# Altium schematic sheet STM32_F4VE.SchDoc
size A2
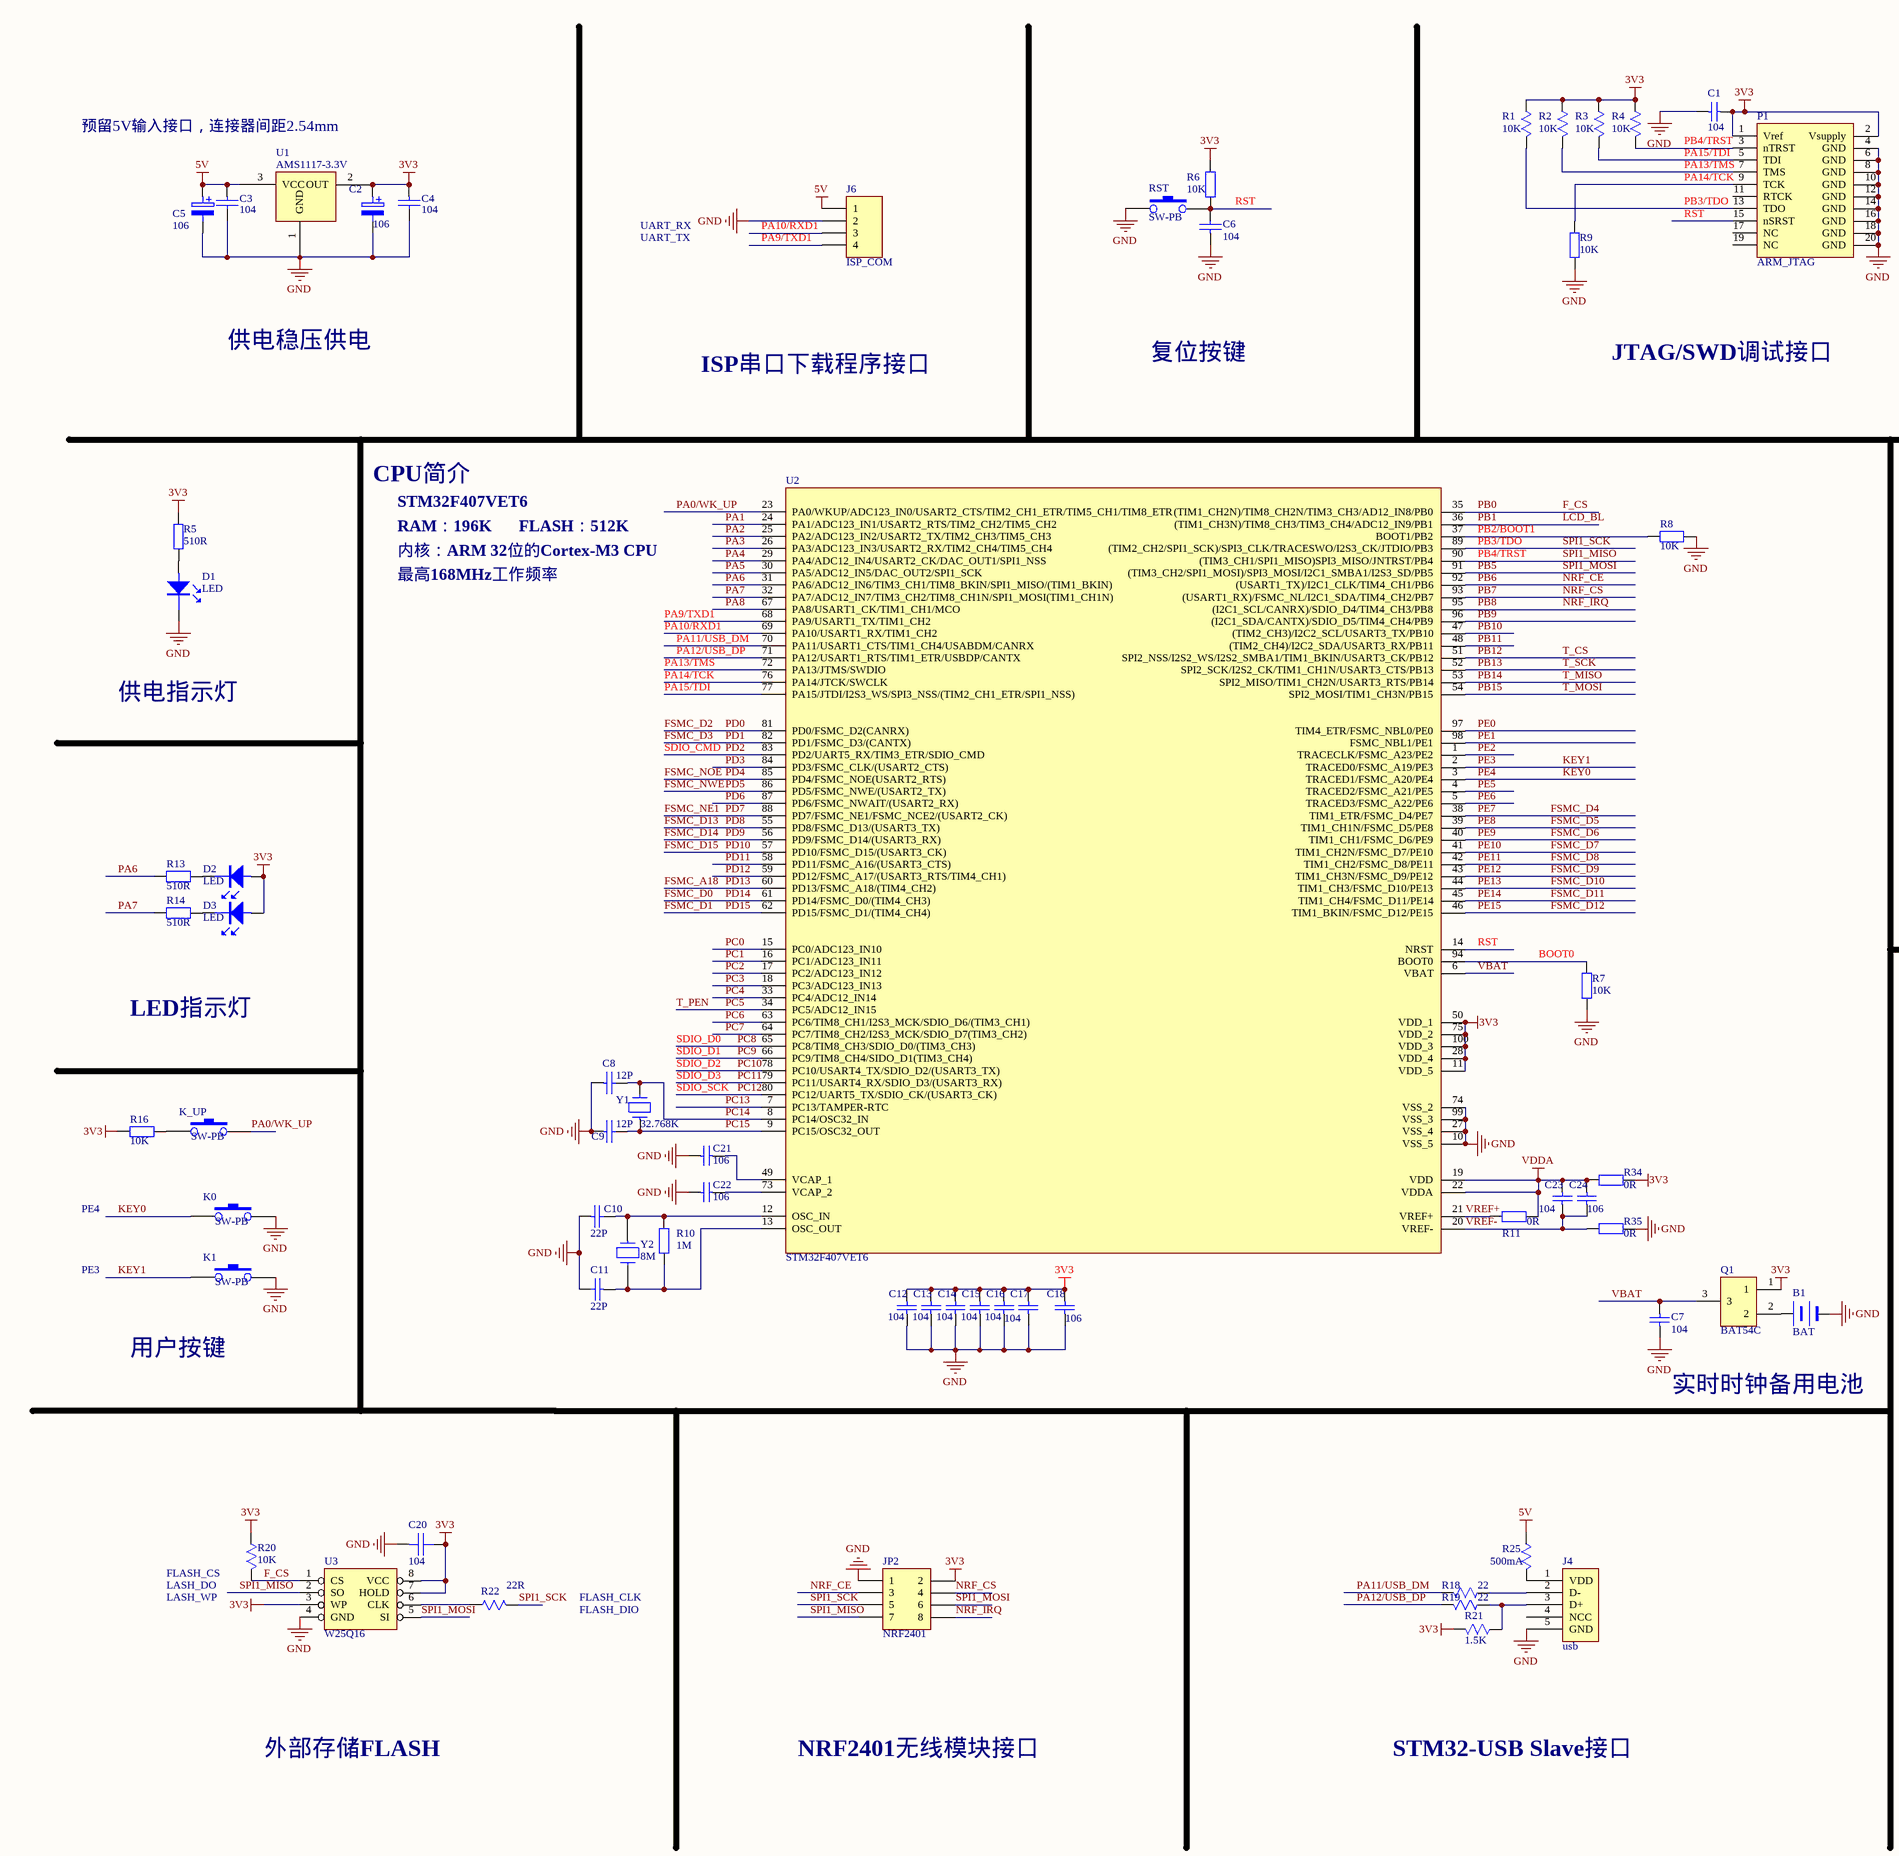
[diagram p0: STM32_F4VE.SchDoc, left]
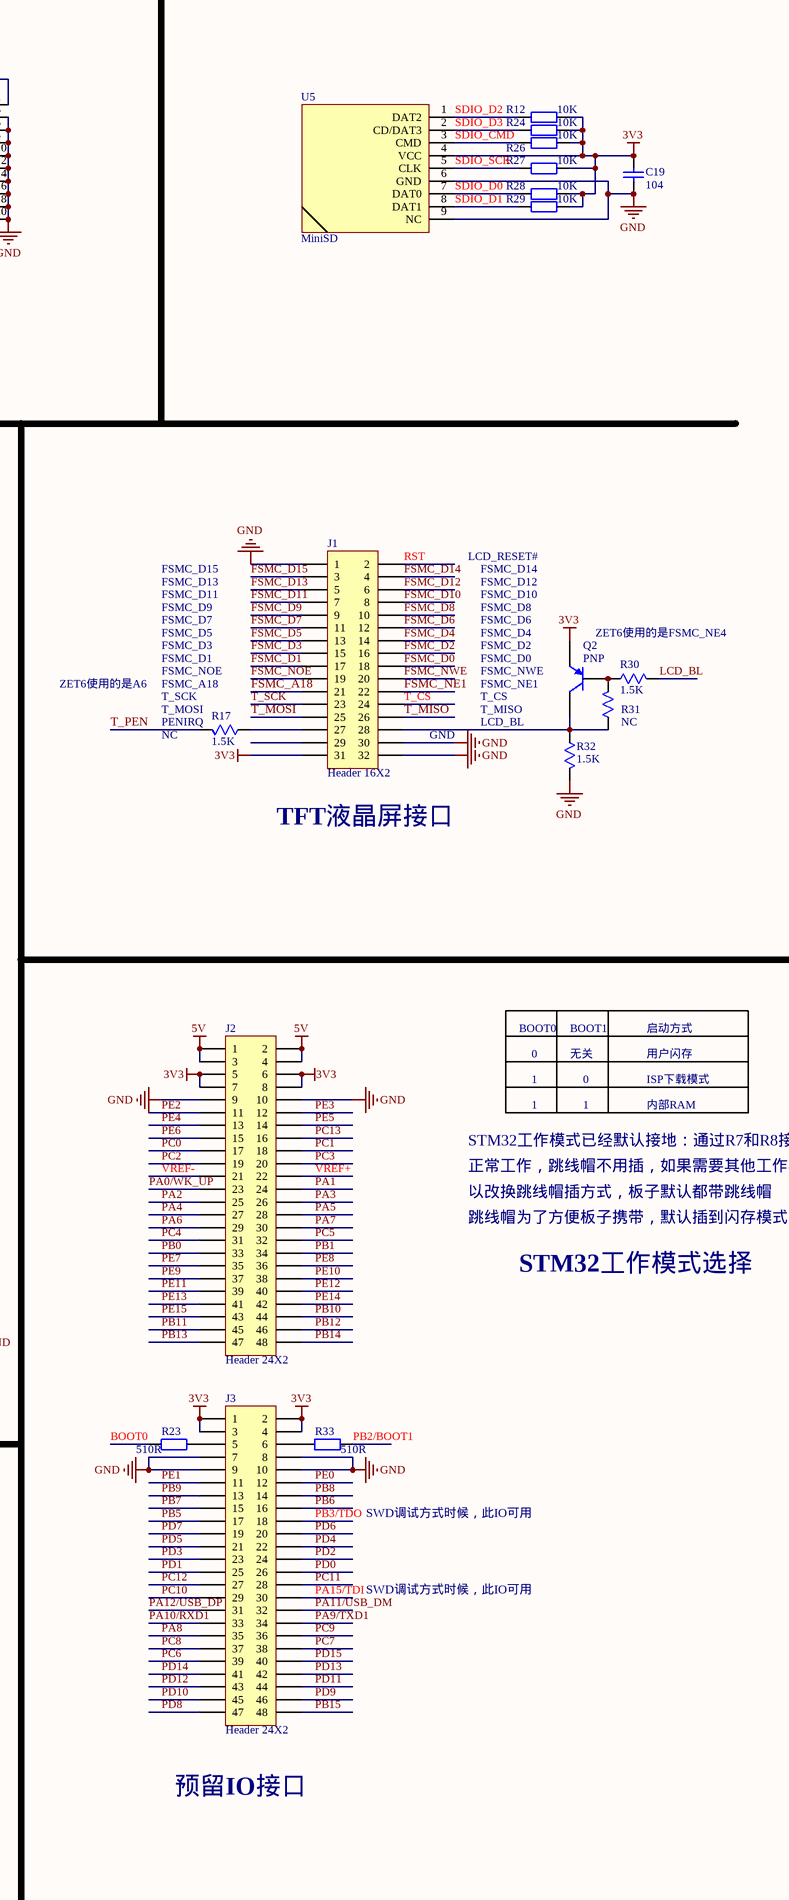
[diagram p1: STM32_F4VE.SchDoc, right]

## Parts
B1  BAT  [BAT]
C1  104  [RC0603]
C2  106  [RC0805]
C3  104  [RC0603]
C4  104  [RC0603]
C5  106  [RC0805]
C6  104  [RC0603]
C7  104  [RC0603]
C8  12P  [RC0603]
C9  12P  [RC0603]
C10  22P  [RC0603]
C11  22P  [RC0603]
C12  104  [RC0603]
C13  104  [RC0603]
C14  104  [RC0603]
C15  104  [RC0603]
C16  104  [RC0603]
C17  104  [RC0603]
C18  106  [RC0805]
C19  104  [RC0603]
C20  104  [RC0603]
C21  106  [RC0805]
C22  106  [RC0805]
C23  104  [RC0603]
C24  106  [RC0805]
D1  LED  [LED0805]
D2  LED  [LED0805]
D3  LED  [LED0805]
J1  Header 16X2  [IDE2X16]
J2  Header 24X2  [IDE2X24]
J3  Header 24X2  [IDE2X24]
J4  usb  [Mini_USB]
J6  ISP_COM  [HDR1X4]
JP2  NRF2401  [IDE2X4]
K0  SW-PB  [SW-SPST]
K1  SW-PB  [SW-SPST]
K_UP  SW-PB  [SW-SPST]
P1  ARM_JTAG  [JTAG-20P]
Q1  BAT54C  [SOT-23-BAT54C]
Q2  PNP  [PNP_SOT23]
R1  10K  [RC0603]
R2  10K  [RC0603]
R3  10K  [RC0603]
R4  10K  [RC0603]
R5  510R  [RC0603]
R6  10K  [RC0603]
R7  10K  [RC0603]
R8  10K  [RC0603]
R9  10K  [RC0603]
R10  1M  [RC0603]
R11  0R  [RC0603]
R12  10K  [RC0603]
R13  510R  [RC0603]
R14  510R  [RC0603]
R16  10K  [RC0603]
R17  1.5K  [RC0603]
R18  22  [RC0603]
R19  22  [RC0603]
R20  10K  [RC0603]
R21  1.5K  [RC0603]
R22  22R  [RC0603]
R23  510R  [RC0603]
R24  10K  [RC0603]
R25  500mA  [RC0805]
R26  10K  [RC0603]
R27  10K  [RC0603]
R28  10K  [RC0603]
R29  10K  [RC0603]
R30  1.5K  [RC0603]
R31  NC  [RC0603]
R32  1.5K  [RC0603]
R33  510R  [RC0603]
R34  0R  [RC0603]
R35  0R  [RC0603]
RST  SW-PB  [SW-SPST]
U1  AMS1117-3.3V  [SOT-223]
U2  STM32F407VET6
U3  W25Q16  [SOP8L]
U5  MiniSD  [TF_SD]
Y1  32.768K  [JZ32768]
Y2  8M  [49S_SMD]

## Nets
3V3: C1.2 C2.1 C4.1 C12.1 C13.1 C14.1 C15.1 C16.1 C17.1 C18.1 C19.1 C20.2 D2.1 D3.1 J1.31 J2.5 J2.6 J2.7 J2.8 J3.1 J3.2 J3.3 J3.4 JP2.2 P1.1(Vref) P1.2(Vsupply) Q1.1 Q2.2(E) R1.1 R2.1 R3.1 R4.1 R5.2 R6.1 R12.2 R16.2 R20.1 R21.2 R24.2 R26.2 R27.2 R28.2 R29.2 R34.2 U1.2(OUT) U2.11(VDD_5) U2.28(VDD_4) U2.50(VDD_1) U2.75(VDD_2) U2.100(VDD_3) U3.3(WP) U3.7(HOLD) U3.8(VCC) U5.4(VCC)
5V: C3.1 C5.1 J2.1 J2.2 J2.3 J2.4 J6.1 R25.1 U1.3(VCC)
GND: B1.2 C1.1 C2.2 C3.2 C4.2 C5.2 C6.1 C7.1 C8.1 C9.1 C10.1 C11.2 C12.2 C13.2 C14.2 C15.2 C16.2 C17.2 C18.2 C19.2 C20.1 C21.1 C22.1 D1.2 J1.1 J1.30 J1.32 J2.9 J2.10 J3.7 J3.8 J3.9 J3.10 J4.5(GND) J6.2 JP2.1 K0.2 K1.2 P1.4(GND) P1.6(GND) P1.8(GND) P1.10(GND) P1.12(GND) P1.14(GND) P1.16(GND) P1.18(GND) P1.20(GND) R7.1 R8.1 R9.1 R32.2 R35.2 RST.1 U1.1(GND) U2.10(VSS_5) U2.27(VSS_4) U2.74(VSS_2) U2.99(VSS_3) U3.4(GND) U5.6(GND) U5.9(NC)
VDDA: C23.1 C24.1 R11.2 R34.1 U2.19(VDD) U2.22(VDDA)
BOOT0: R7.2 R23.1 U2.94(BOOT0)
F_CS: J2.33 R20.2 U2.35((TIM1_CH2N)/TIM8_CH2N/TIM3_CH3/AD12_IN8/PB0) U3.1(CS)  [also labelled PB0]
FSMC_A18: J1.21 J3.42 U2.60(PD13/FSMC_A18/(TIM4_CH2))  [also labelled PD13]
FSMC_D0: J1.18 J3.41 U2.61(PD14/FSMC_D0/(TIM4_CH3))  [also labelled PD14]
FSMC_D1: J1.17 J3.40 U2.62(PD15/FSMC_D1/(TIM4_CH4))  [also labelled PD15]
FSMC_D2: J1.16 J3.26 U2.81(PD0/FSMC_D2(CANRX))  [also labelled PD0]
FSMC_D3: J1.15 J3.25 U2.82(PD1/FSMC_D3/(CANTX))  [also labelled PD1]
FSMC_D4: J1.14 J2.35 U2.38(TIM1_ETR/FSMC_D4/PE7)  [also labelled PE7]
FSMC_D5: J1.13 J2.36 U2.39(TIM1_CH1N/FSMC_D5/PE8)  [also labelled PE8]
FSMC_D6: J1.12 J2.37 U2.40(TIM1_CH1/FSMC_D6/PE9)  [also labelled PE9]
FSMC_D7: J1.11 J2.38 U2.41(TIM1_CH2N/FSMC_D7/PE10)  [also labelled PE10]
FSMC_D8: J1.10 J2.39 U2.42(TIM1_CH2/FSMC_D8/PE11)  [also labelled PE11]
FSMC_D9: J1.9 J2.40 U2.43(TIM1_CH3N/FSMC_D9/PE12)  [also labelled PE12]
FSMC_D10: J1.8 J2.41 U2.44(TIM1_CH3/FSMC_D10/PE13)  [also labelled PE13]
FSMC_D11: J1.7 J2.42 U2.45(TIM1_CH4/FSMC_D11/PE14)  [also labelled PE14]
FSMC_D12: J1.6 J2.43 U2.46(TIM1_BKIN/FSMC_D12/PE15)  [also labelled PE15]
FSMC_D13: J1.5 J3.47 U2.55(PD8/FSMC_D13/(USART3_TX))  [also labelled PD8]
FSMC_D14: J1.4 J3.46 U2.56(PD9/FSMC_D14/(USART3_RX))  [also labelled PD9]
FSMC_D15: J1.3 J3.45 U2.57(PD10/FSMC_D15/(USART3_CK))  [also labelled PD10]
FSMC_NE1: J1.22 J3.19 U2.88(PD7/FSMC_NE1/FSMC_NCE2/(USART2_CK))  [also labelled PD7]
FSMC_NOE: J1.19 J3.22 U2.85(PD4/FSMC_NOE(USART2_RTS))  [also labelled PD4]
FSMC_NWE: J1.20 J3.21 U2.86(PD5/FSMC_NWE/(USART2_TX))  [also labelled PD5]
KEY0: J2.13 K0.1 U2.3(TRACED1/FSMC_A20/PE4)  [also labelled PE4]
KEY1: J2.12 K1.1 U2.2(TRACED0/FSMC_A19/PE3)  [also labelled PE3]
LCD_BL: J2.34 R30.2 U2.36((TIM1_CH3N)/TIM8_CH3/TIM3_CH4/ADC12_IN9/PB1)  [also labelled PB1]
NRF_CE: J3.16 JP2.3 U2.92((USART1_TX)/I2C1_CLK/TIM4_CH1/PB6)  [also labelled PB6]
NRF_CS: J3.15 JP2.4 U2.93((USART1_RX)/FSMC_NL/I2C1_SDA/TIM4_CH2/PB7)  [also labelled PB7]
NRF_IRQ: J3.14 JP2.8 U2.95((I2C1_SCL/CANRX)/SDIO_D4/TIM4_CH3/PB8)  [also labelled PB8]
PA0/WK_UP: J2.23 K_UP.2 U2.23(PA0/WKUP/ADC123_IN0/USART2_CTS/TIM2_CH1_ETR/TIM5_CH1/TIM8_ETR)
PA1: J2.24 U2.24(PA1/ADC123_IN1/USART2_RTS/TIM2_CH2/TIM5_CH2)
PA2: J2.25 U2.25(PA2/ADC123_IN2/USART2_TX/TIM2_CH3/TIM5_CH3)
PA3: J2.26 U2.26(PA3/ADC123_IN3/USART2_RX/TIM2_CH4/TIM5_CH4)
PA4: J2.27 U2.29(PA4/ADC12_IN4/USART2_CK/DAC_OUT1/SPI1_NSS)
PA5: J2.28 U2.30(PA5/ADC12_IN5/DAC_OUT2/SPI1_SCK)
PA6: J2.29 R13.1 U2.31(PA6/ADC12_IN6/TIM3_CH1/TIM8_BKIN/SPI1_MISO/(TIM1_BKIN))
PA7: J2.30 R14.1 U2.32(PA7/ADC12_IN7/TIM3_CH2/TIM8_CH1N/SPI1_MOSI(TIM1_CH1N))
PA8: J3.35 U2.67(PA8/USART1_CK/TIM1_CH1/MCO)
PA9/TXD1: J3.34 J6.4 U2.68(PA9/USART1_TX/TIM1_CH2)
PA10/RXD1: J3.33 J6.3 U2.69(PA10/USART1_RX/TIM1_CH2)
PA11/USB_DM: J3.32 R18.2 U2.70(PA11/USART1_CTS/TIM1_CH4/USABDM/CANRX)
PA12/USB_DP: J3.31 R19.2 U2.71(PA12/USART1_RTS/TIM1_ETR/USBDP/CANTX)
PA13/TMS: P1.7(TMS) R2.2 U2.72(PA13/JTMS/SWDIO)
PA14/TCK: P1.9(TCK) R9.2 U2.76(PA14/JTCK/SWCLK)
PA15/TDI: J3.30 P1.5(TDI) R3.2 U2.77(PA15/JTDI/I2S3_WS/SPI3_NSS/(TIM2_CH1_ETR/SPI1_NSS))
PB2/BOOT1: R8.2 R33.2 U2.37(BOOT1/PB2)
PB3/TDO: J3.18 JP2.5 P1.13(TDO) R1.2 R22.2 U2.89((TIM2_CH2/SPI1_SCK)/SPI3_CLK/TRACESWO/I2S3_CK/JTDIO/PB3)  [also labelled SPI1_SCK]
PB4/TRST: JP2.7 P1.3(nTRST) R4.2 U2.90((TIM3_CH1/SPI1_MISO)SPI3_MISO/JNTRST/PB4) U3.2(SO)  [also labelled SPI1_MISO]
PB5: J3.17 JP2.6 U2.91((TIM3_CH2/SPI1_MOSI)/SPI3_MOSI/I2C1_SMBA1/I2S3_SD/PB5) U3.5(SI)  [also labelled SPI1_MOSI]
PB9: J3.13 U2.96((I2C1_SDA/CANTX)/SDIO_D5/TIM4_CH4/PB9)
PB10: J2.44 U2.47((TIM2_CH3)/I2C2_SCL/USART3_TX/PB10)
PB11: J2.45 U2.48((TIM2_CH4)/I2C2_SDA/USART3_RX/PB11)
PB12: J1.24 J2.46 U2.51(SPI2_NSS/I2S2_WS/I2S2_SMBA1/TIM1_BKIN/USART3_CK/PB12)  [also labelled T_CS]
PB13: J1.23 J2.47 U2.52(SPI2_SCK/I2S2_CK/TIM1_CH1N/USART3_CTS/PB13)  [also labelled T_SCK]
PB14: J1.26 J2.48 U2.53(SPI2_MISO/TIM1_CH2N/USART3_RTS/PB14)  [also labelled T_MISO]
PB15: J1.25 J3.48 U2.54(SPI2_MOSI/TIM1_CH3N/PB15)  [also labelled T_MOSI]
PC0: J2.17 U2.15(PC0/ADC123_IN10)
PC1: J2.18 U2.16(PC1/ADC123_IN11)
PC2: J2.19 U2.17(PC2/ADC123_IN12)
PC3: J2.20 U2.18(PC3/ADC123_IN13)
PC4: J2.31 U2.33(PC4/ADC12_IN14)
PC5: J2.32 R17.2 U2.34(PC5/ADC12_IN15)  [also labelled T_PEN]
PC6: J3.39 U2.63(PC6/TIM8_CH1/I2S3_MCK/SDIO_D6/(TIM3_CH1))
PC7: J3.38 U2.64(PC7/TIM8_CH2/I2S3_MCK/SDIO_D7(TIM3_CH2))
PC8: J3.37 R28.1 U2.65(PC8/TIM8_CH3/SDIO_D0/(TIM3_CH3)) U5.7(DAT0)  [also labelled SDIO_D0]
PC9: J3.36 R29.1 U2.66(PC9/TIM8_CH4/SIDO_D1(TIM3_CH4)) U5.8(DAT1)  [also labelled SDIO_D1]
PC10: J3.29 R12.1 U2.78(PC10/USART4_TX/SDIO_D2/(USART3_TX)) U5.1(DAT2)  [also labelled SDIO_D2]
PC11: J3.28 R24.1 U2.79(PC11/USART4_RX/SDIO_D3/(USART3_RX)) U5.2(CD/DAT3)  [also labelled SDIO_D3]
PC12: J3.27 R27.1 U2.80(PC12/UART5_TX/SDIO_CK/(USART3_CK)) U5.5(CLK)  [also labelled SDIO_SCK]
PC13: J2.16 U2.7(PC13/TAMPER-RTC)
PC14: C8.2 U2.8(PC14/OSC32_IN) Y1.2
PC15: C9.2 U2.9(PC15/OSC32_OUT) Y1.1
PD2: J3.24 R26.1 U2.83(PD2/UART5_RX/TIM3_ETR/SDIO_CMD) U5.3(CMD)  [also labelled SDIO_CMD]
PD3: J3.23 U2.84(PD3/FSMC_CLK/(USART2_CTS))
PD6: J3.20 U2.87(PD6/FSMC_NWAIT/(USART2_RX))
PD11: J3.44 U2.58(PD11/FSMC_A16/(USART3_CTS))
PD12: J3.43 U2.59(PD12/FSMC_A17/(USART3_RTS/TIM4_CH1))
PE0: J3.12 U2.97(TIM4_ETR/FSMC_NBL0/PE0)
PE1: J3.11 U2.98(FSMC_NBL1/PE1)
PE2: J2.11 U2.1(TRACECLK/FSMC_A23/PE2)
PE5: J2.14 U2.4(TRACED2/FSMC_A21/PE5)
PE6: J2.15 U2.5(TRACED3/FSMC_A22/PE6)
RST: C6.2 J1.2 P1.15(nSRST) R6.2 RST.2 U2.14(NRST)
VBAT: C7.2 Q1.3 U2.6(VBAT)
VREF+: J2.22 R11.1 U2.21(VREF+)
VREF-: C23.2 C24.2 J2.21 R35.1 U2.20(VREF-)
NetB1_1: B1.1 Q1.2
NetC10_2: C10.2 R10.1 U2.12(OSC_IN) Y2.1
NetC11_1: C11.1 R10.2 U2.13(OSC_OUT) Y2.2
NetC21_2: C21.2 U2.49(VCAP_1)
NetC22_2: C22.2 U2.73(VCAP_2)
NetD1_1: D1.1 R5.1
NetD2_2: D2.2 R13.2
NetD3_2: D3.2 R14.2
NetJ1_27: J1.27 R17.1
NetJ1_28: J1.28 Q2.3(C) R31.1 R32.1
NetJ3_5: J3.5 R23.2
NetJ3_6: J3.6 R33.1
NetJ4_1: J4.1(VDD) R25.2
NetJ4_2: J4.2(D-) R18.1
NetJ4_3: J4.3(D+) R19.1 R21.1
NetK_UP_1: K_UP.1 R16.1
NetQ2_1: Q2.1(B) R30.1 R31.2
NetR22_1: R22.1 U3.6(CLK)

Not connected (* = marked no-connect by the designer): J1 29; J4 4(NCC); P1 11(RTCK) 17(NC) 19(NC)

## Notes on the sheet
- 预留5V输入接口，连接器间距2.54mm
- UART_TX
- UART_RX
- 供电稳压供电
- ISP串口下载程序接口
- 复位按键
- JTAG/SWD调试接口
- CPU简介
- STM32F407VET6
- RAM：196K
- 内核：ARM 32位的Cortex-M3 CPU
- 最高168MHz工作频率
- FLASH：512K
- FSMC_D15
- LCD_RESET#
- FSMC_D14
- FSMC_D5
- FSMC_D7
- FSMC_D9
- FSMC_D11
- FSMC_D13
- FSMC_D4
- FSMC_D6
- FSMC_D8
- FSMC_D10
- FSMC_D12
- ZET6使用的是FSMC_NE4
- 供电指示灯
- ZET6使用的是A6
- FSMC_NOE
- (near R17) FSMC_A18
- (near R17) T_SCK
- FSMC_D1
- FSMC_D3
- FSMC_NE1
- (near Q2) FSMC_NWE
- T_CS
- (near Q2) FSMC_D0
- (near Q2) FSMC_D2
- (near R17) NC
- (near R17) T_MOSI
- (near R17) PENIRQ
- GND
- T_MISO
- LCD_BL
- (near J1) TFT液晶屏接口
- LED指示灯
- BOOT0
- 0
- 1
- BOOT1
- 无关
- 启动方式
- 用户闪存
- ISP下载模式
- STM32工作模式已经默认接地：通过R7和R8接地
- 内部RAM
- 正常工作，跳线帽不用插，如果需要其他工作模式可
- 以改换跳线帽插方式，板子默认都带跳线帽
- PE4
- 跳线帽为了方便板子携带，默认插到闪存模式
- STM32工作模式选择
- PE3
- 用户按键
- 实时时钟备用电池
- SWD调试方式时候，此IO可用
- LASH_WP
- (near R20) LASH_DO
- (near R20) FLASH_CS
- FLASH_DIO
- FLASH_CLK
- 外部存储FLASH
- NRF2401无线模块接口
- STM32-USB Slave接口
- 预留IO接口

## Library data of the parts
B1 = BATTERY
C1 C7 C12-C18 C21-C24 = Cap: Capacitor; Published: 8-Jun-2000; LatestRevisionDate: 17-Jul-2002; LatestRevisionNote: Re-released for DXP Platform.; PackageReference: RAD-0.3; Publisher: Altium Limited
C2 C5 = ELECTRO2
C3 C4 C6 C10 C11 = CAP: Capacitor
C8 C9 C20 = CAP
C19 = Cap Semi: Capacitor (Semiconductor SIM Model); Published: 8-Jun-2000; Revision: July-2002: Re-released for DXP Platform.; Publisher: Altium Limited
J1 = Header 16X2: Header, 16-Pin, Dual row; LatestRevisionDate: 17-Jul-2002; LatestRevisionNote: Re-released for DXP Platform.; Publisher: Altium Limited
J2 J3 = Header 24X2: Header, 24-Pin, Dual row; LatestRevisionDate: 17-Jul-2002; LatestRevisionNote: Re-released for DXP Platform.; Publisher: Altium Limited
J6 = Header 4: Header, 4-Pin; LatestRevisionDate: 17-Jul-2002; LatestRevisionNote: Re-released for DXP Platform.; Publisher: Altium Limited
JP2 = Header 4X2: Header, 4-Pin, Dual row; LatestRevisionDate: 17-Jul-2002; LatestRevisionNote: Re-released for DXP Platform.; Publisher: Altium Limited
P1 = JTAG
Q2 = PNP: PNP Bipolar Transistor; Published: 8-Jun-2000; LatestRevisionDate: 29-May-2009; LatestRevisionNote: IPC-7351 Footprint Added.; PackageVersion: Aug-1999; PackageReference: SOT-23B; Publisher: Altium Limited; PackageDescription: 3-Pin SOT-23 Package 0.95 mm Pitch, 2.4 mm Lead Span
R1-R4 R17-R22 R25 R30-R32 = RES
R5-R14 R16 R23 R24 R26-R29 R33-R35 = Res2: Resistor
U1 = 11
U3 = W25X16
Y1 = CRYSTAL: 晶振
Y2 = CRYSTAL